# EasyEDA schematic ThrustElectronicBoard2022.json

## Sheets
1 Sheet_1: TITLE: Microcontroller; REV: 0.1; Date: 01-09-2022; Sheet: 1/5; Drawn By: Marcazzan Mirco; Company: Università degli studi di Padova
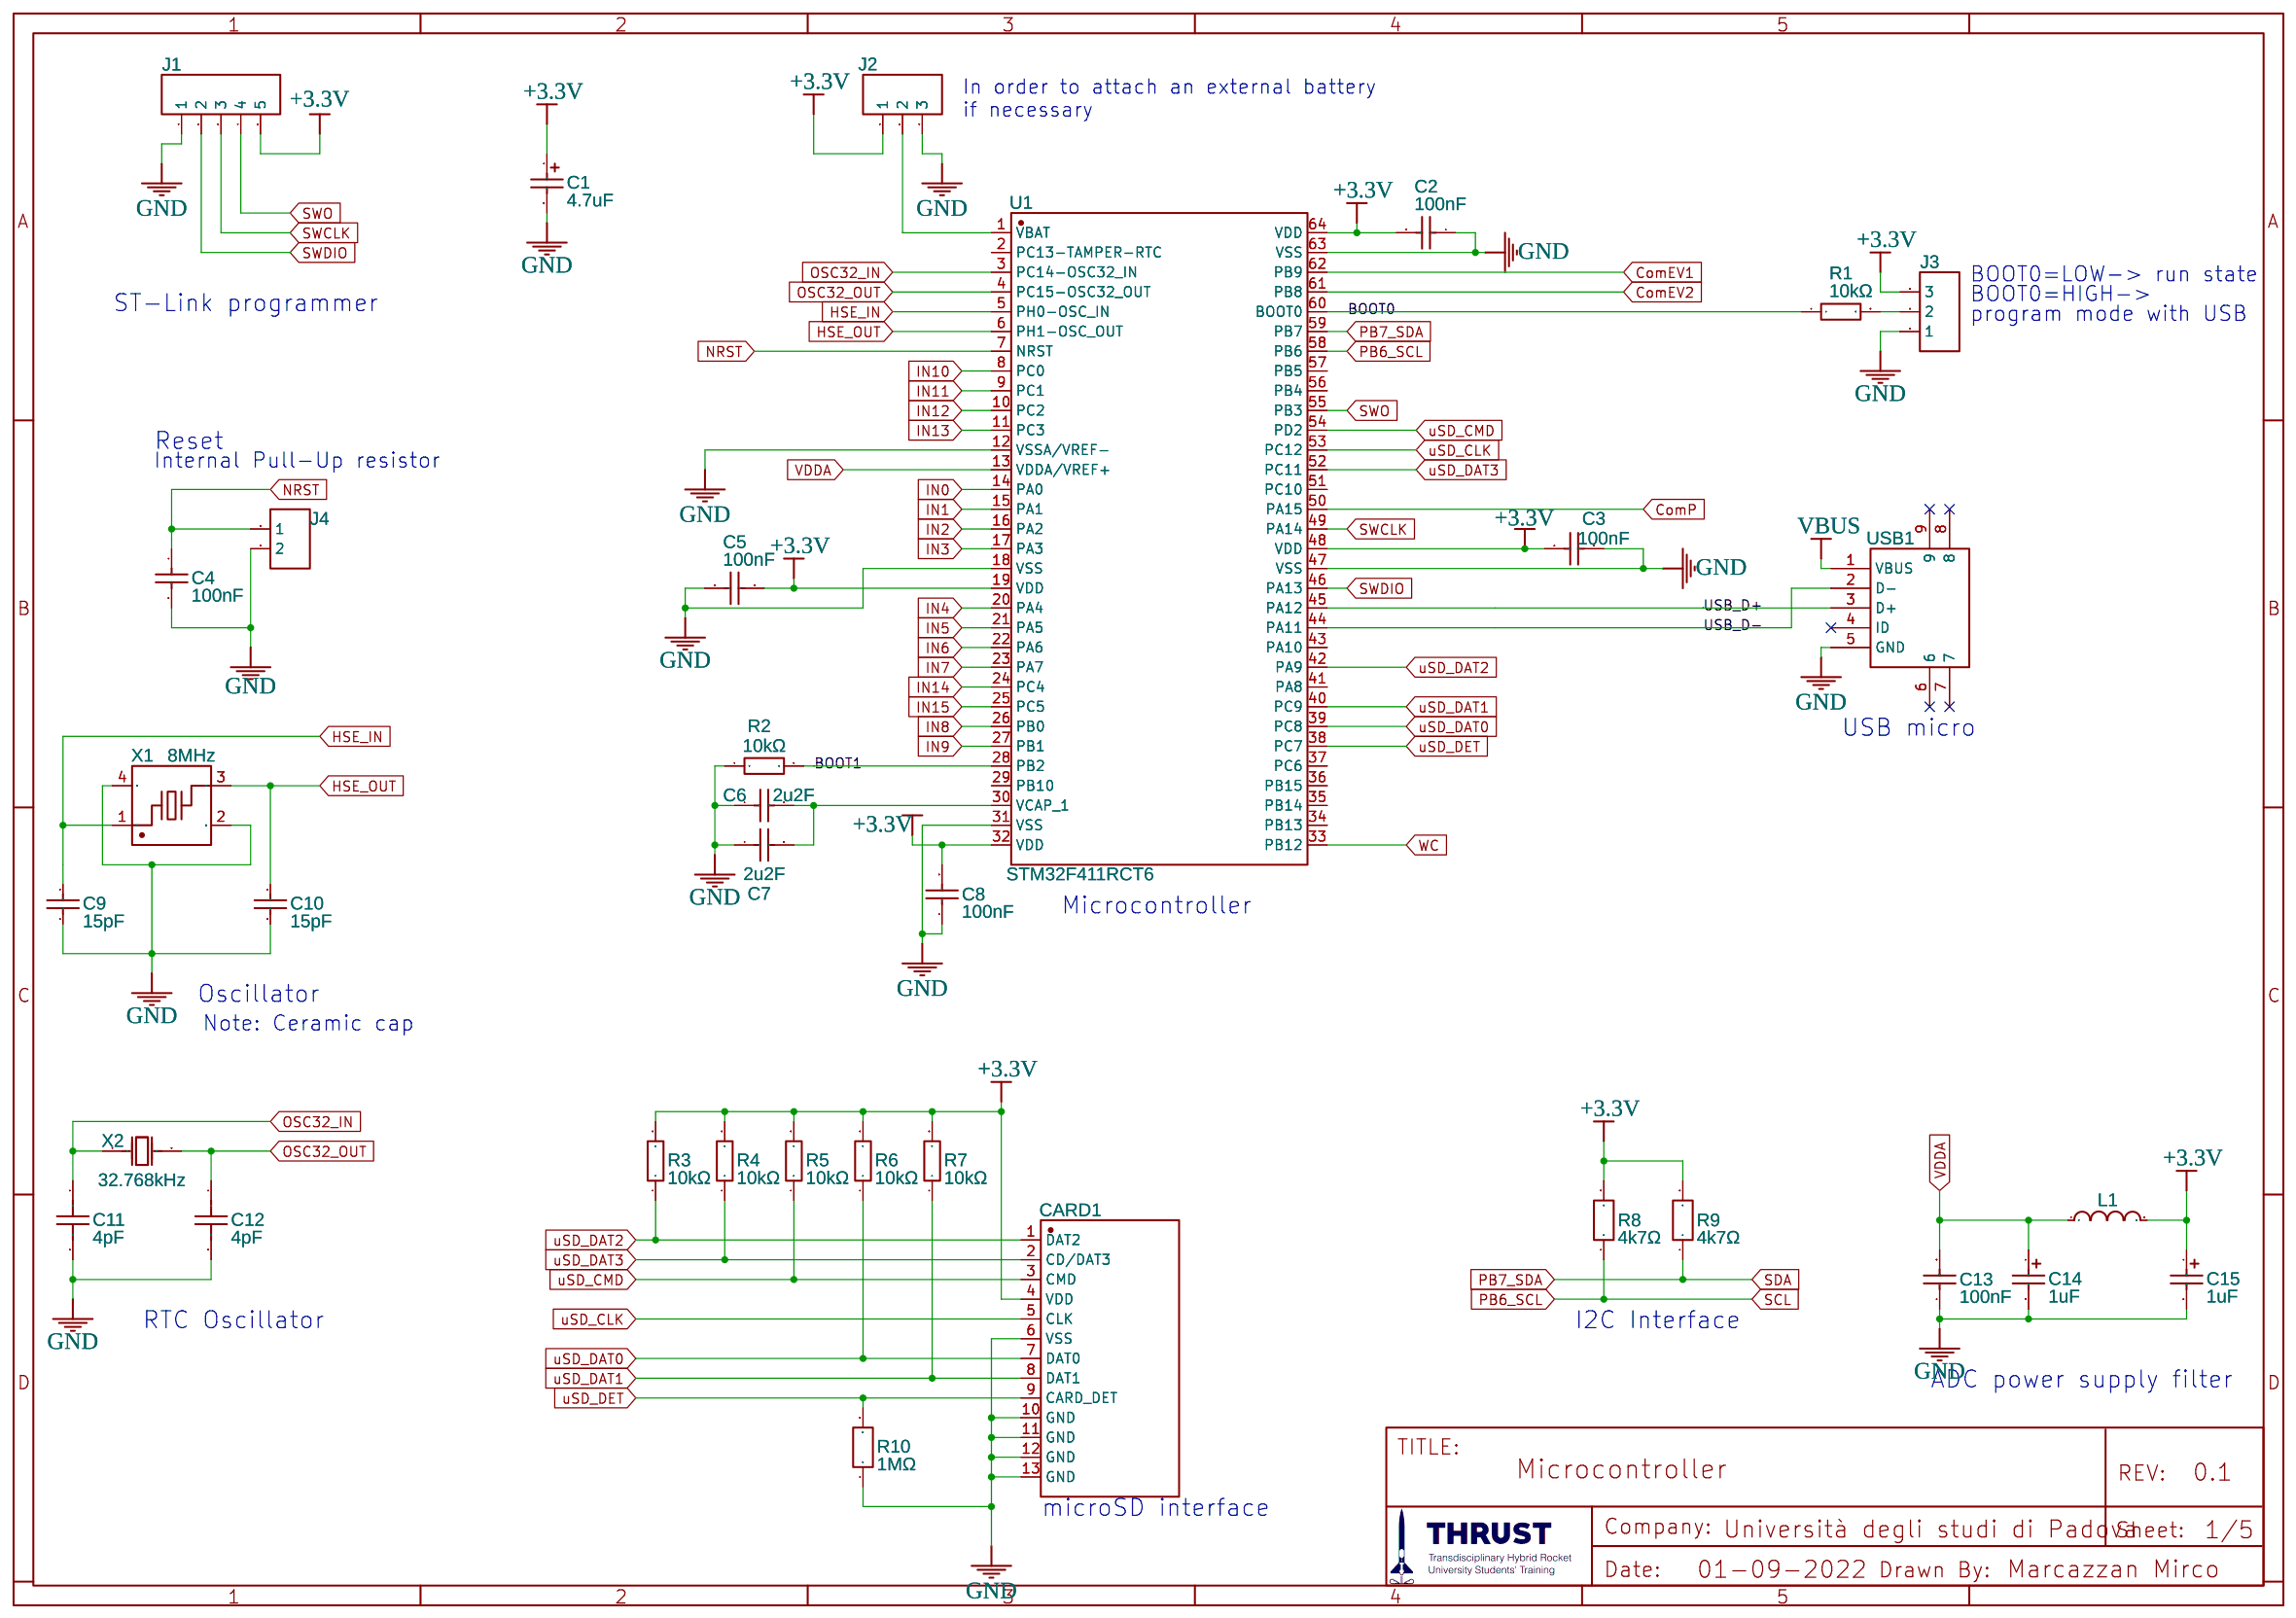
[diagram p0: Sheet_1]
2 Sheet_2: TITLE: IMU, EEPROM; REV: 1.0; Sheet: 2/5
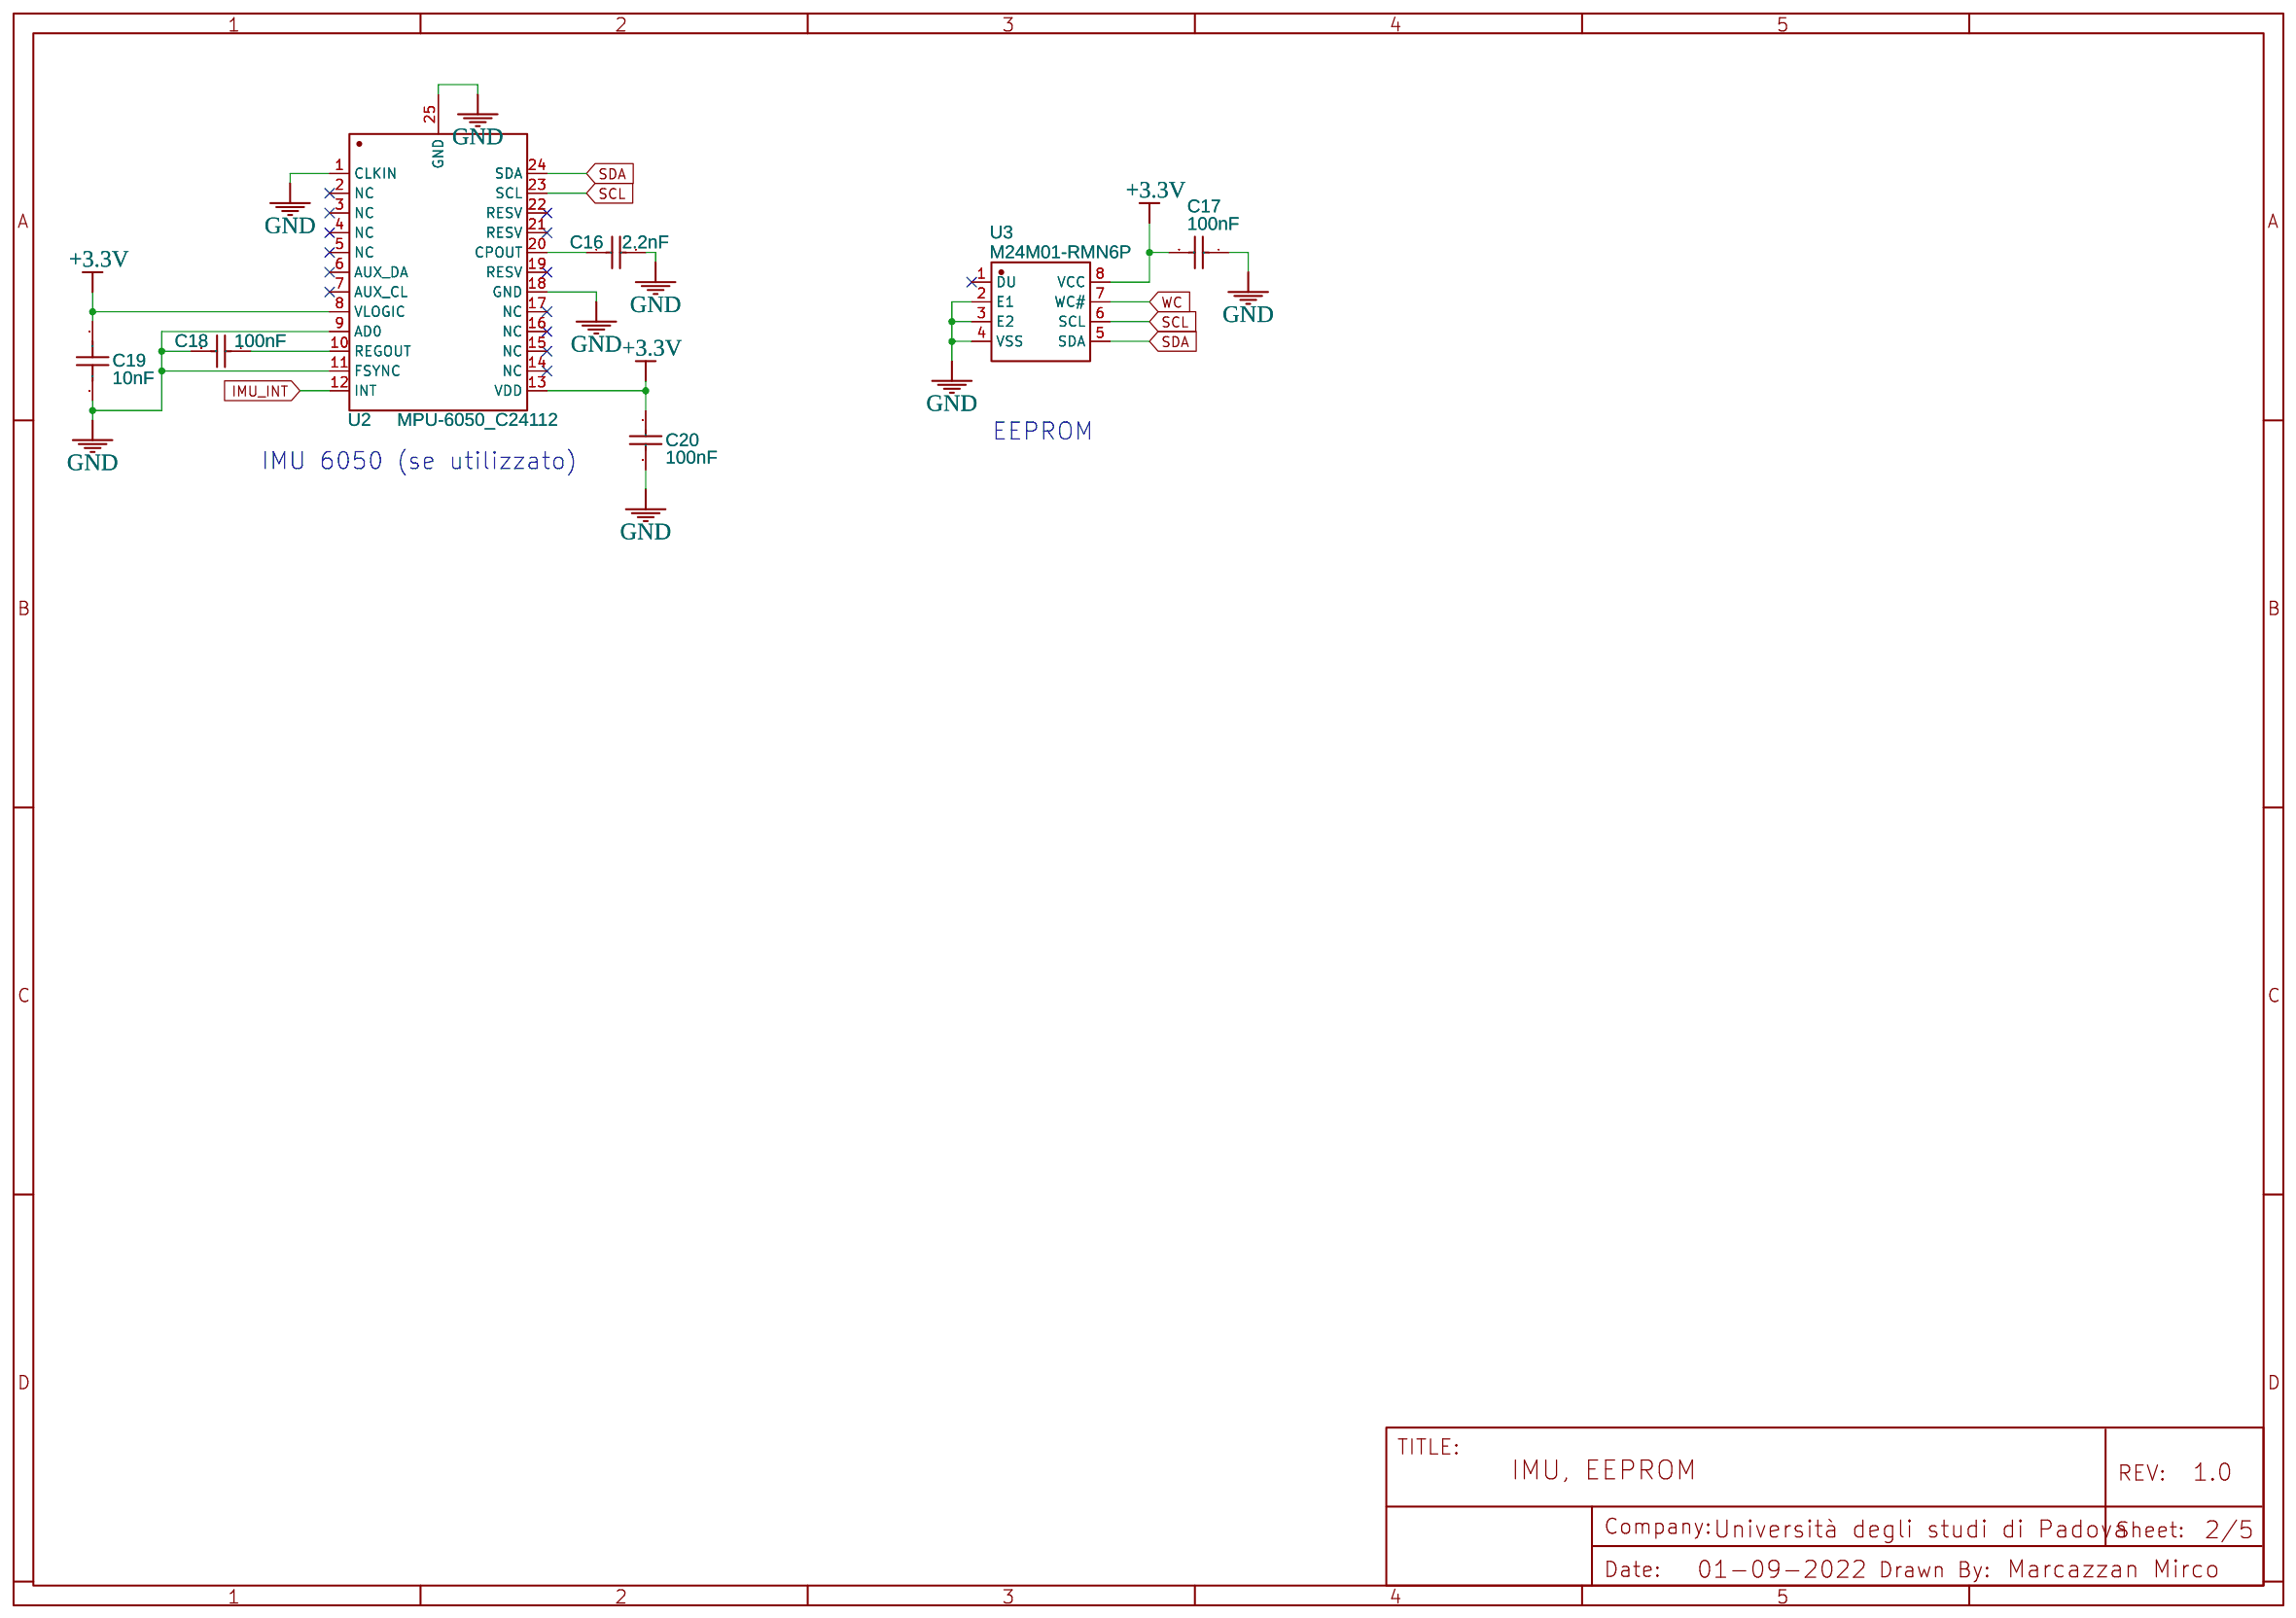
[diagram p1: Sheet_2]
3 Sheet_3: TITLE: Condizionamento sensori; Sheet: 3/5
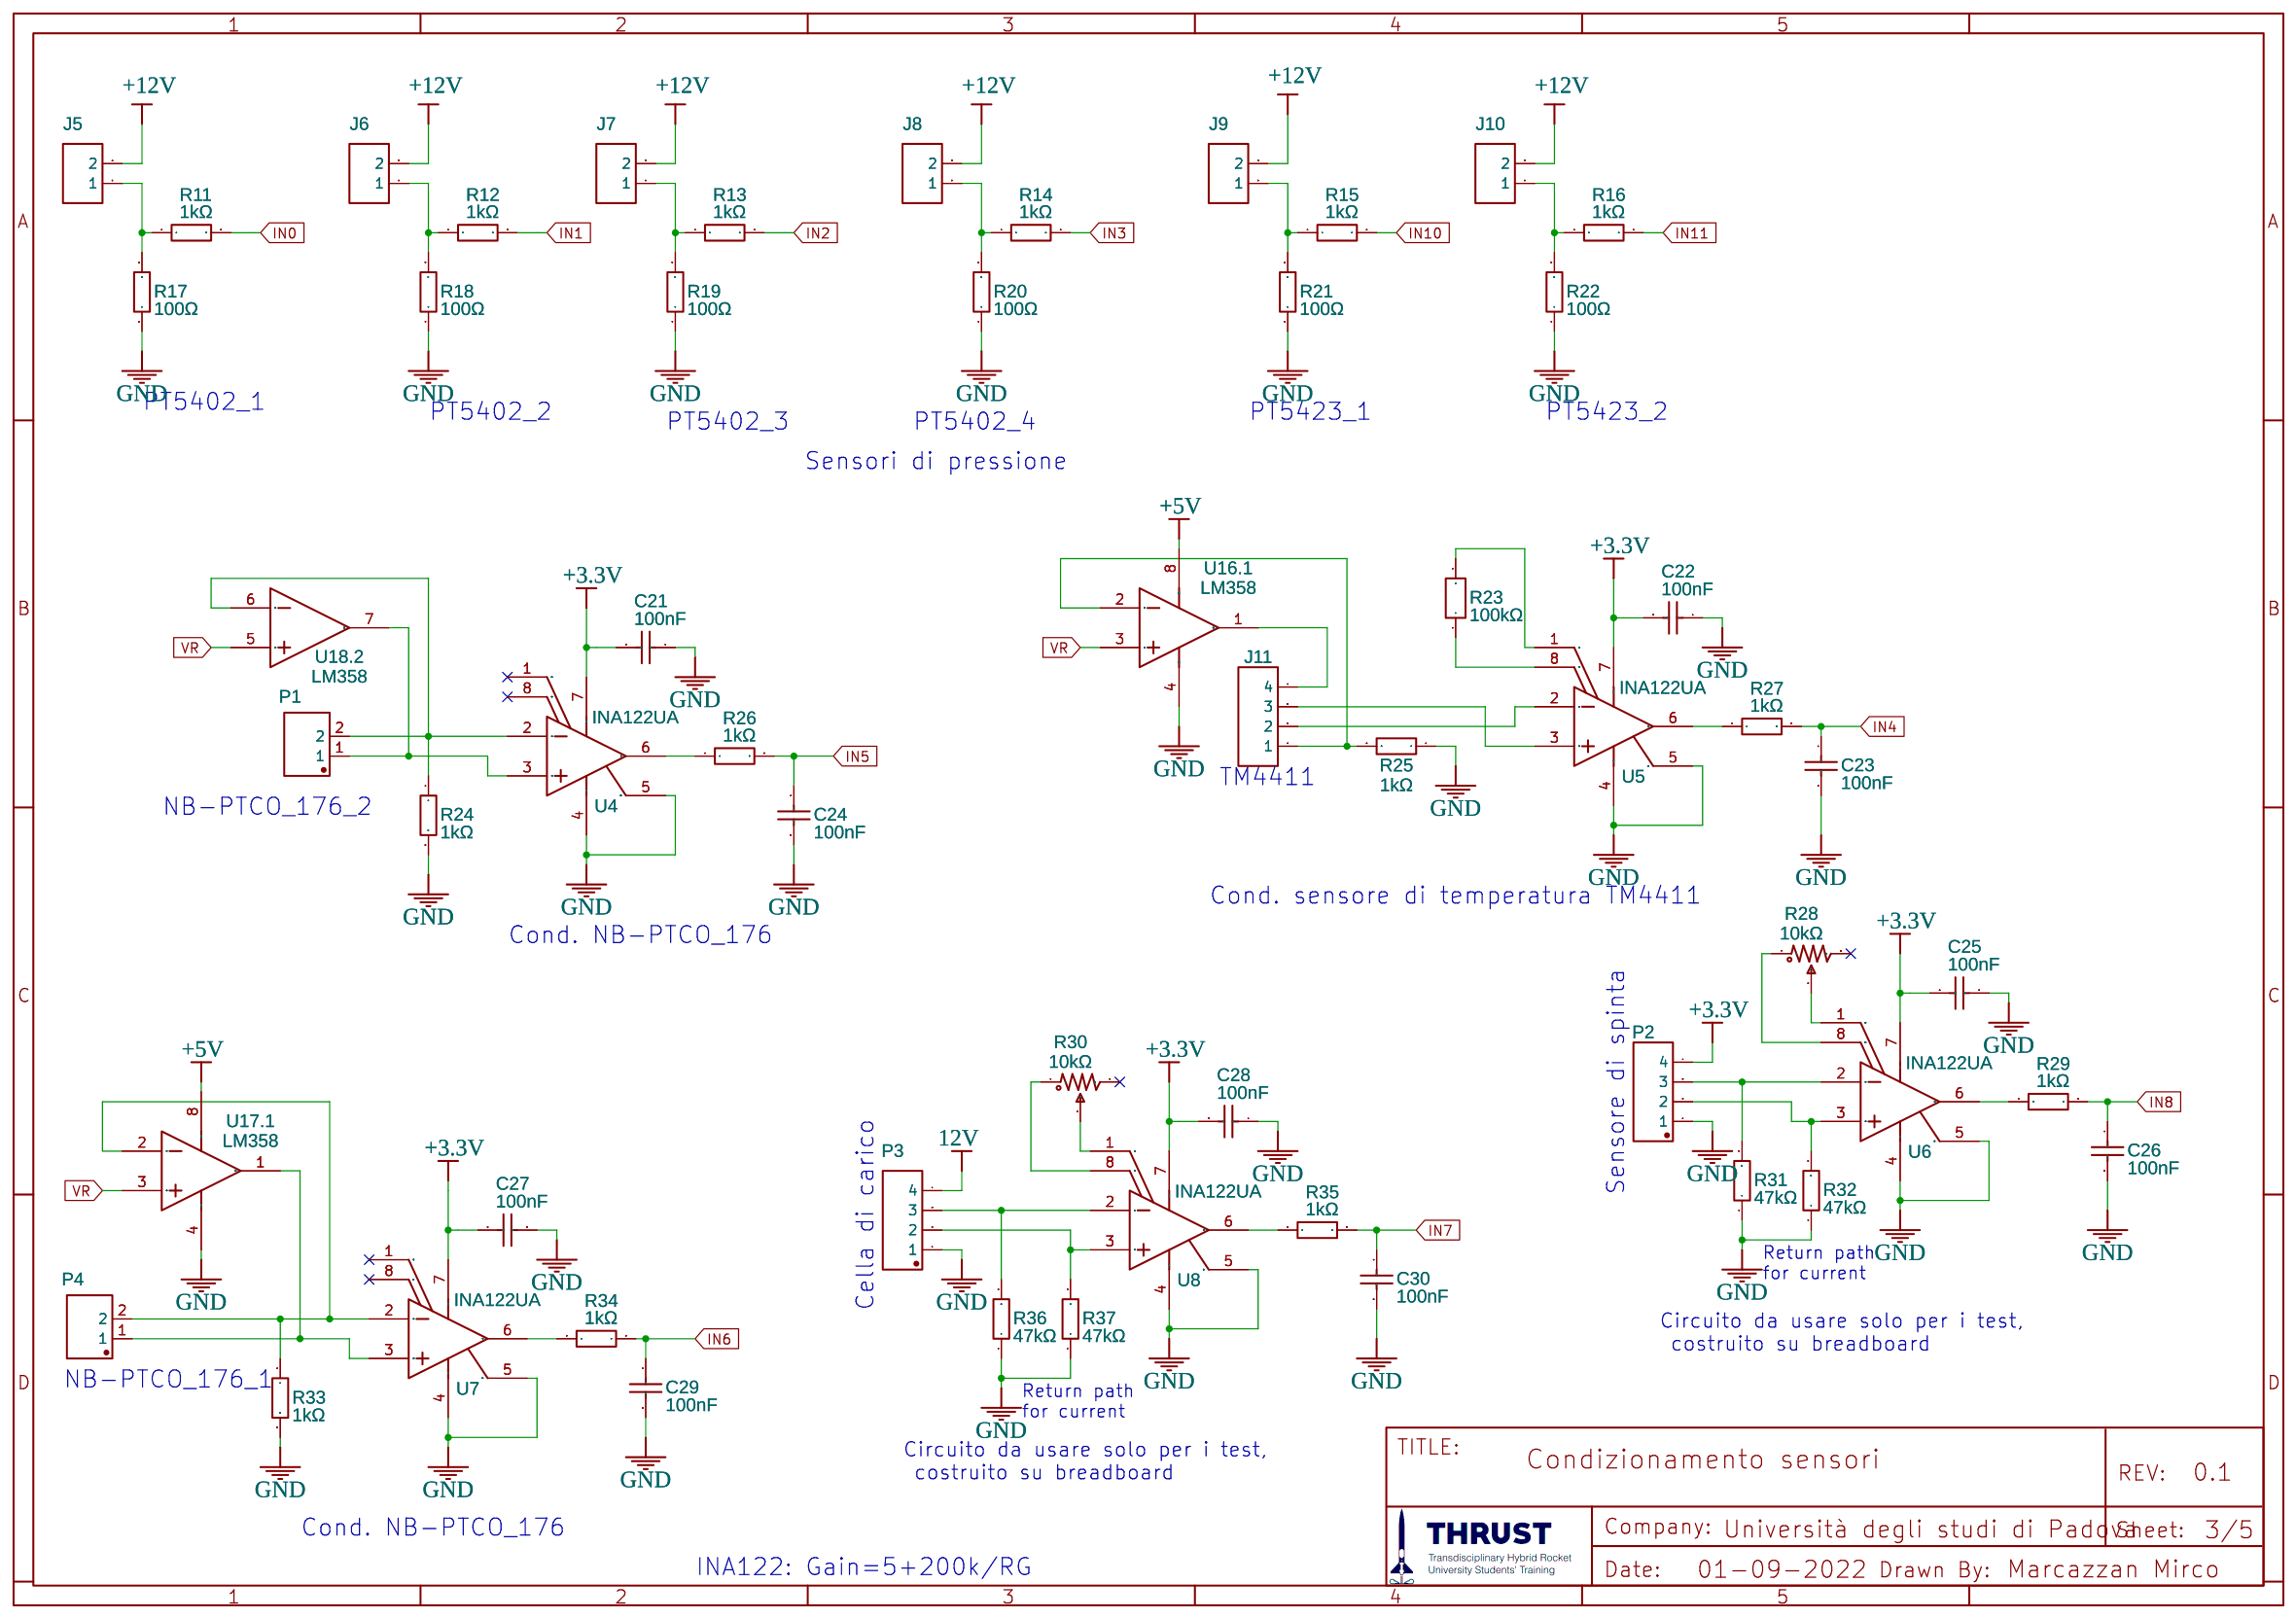
[diagram p2: Sheet_3]
4 Sheet_4: TITLE: Azionamenti; Sheet: 4/5
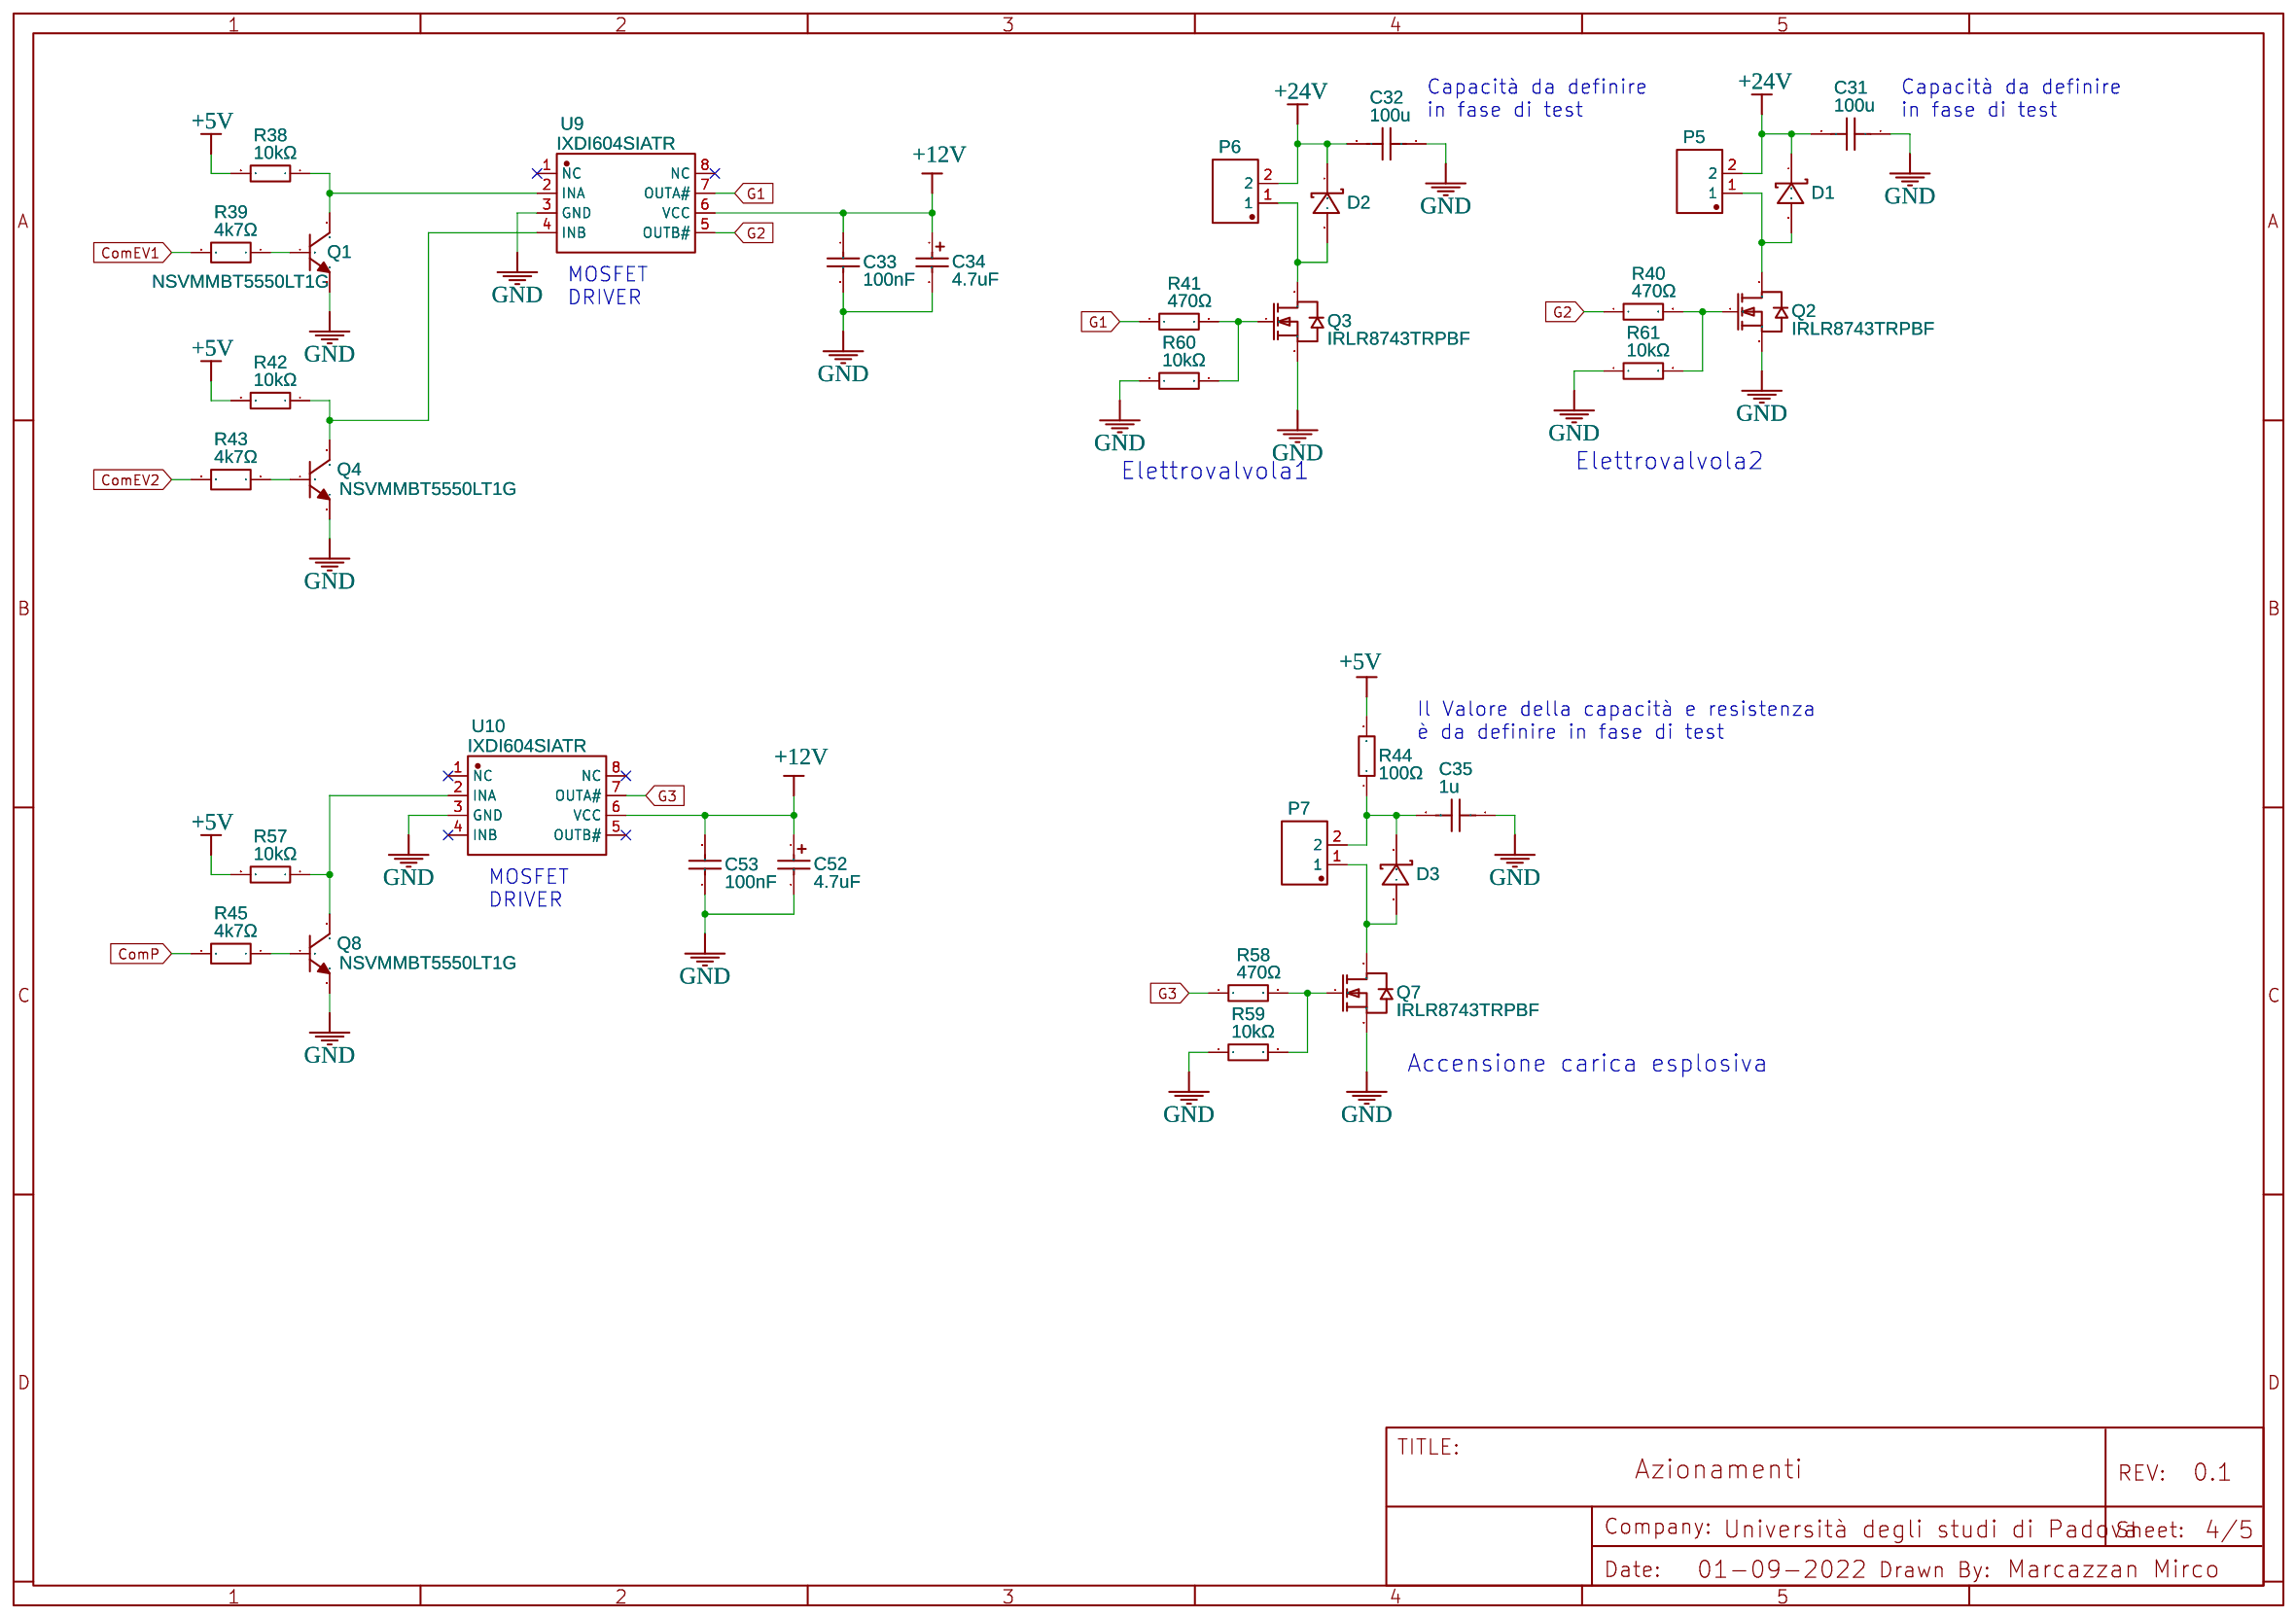
[diagram p3: Sheet_4]
5 Sheet_5: TITLE: Energy management; Sheet: 5/5
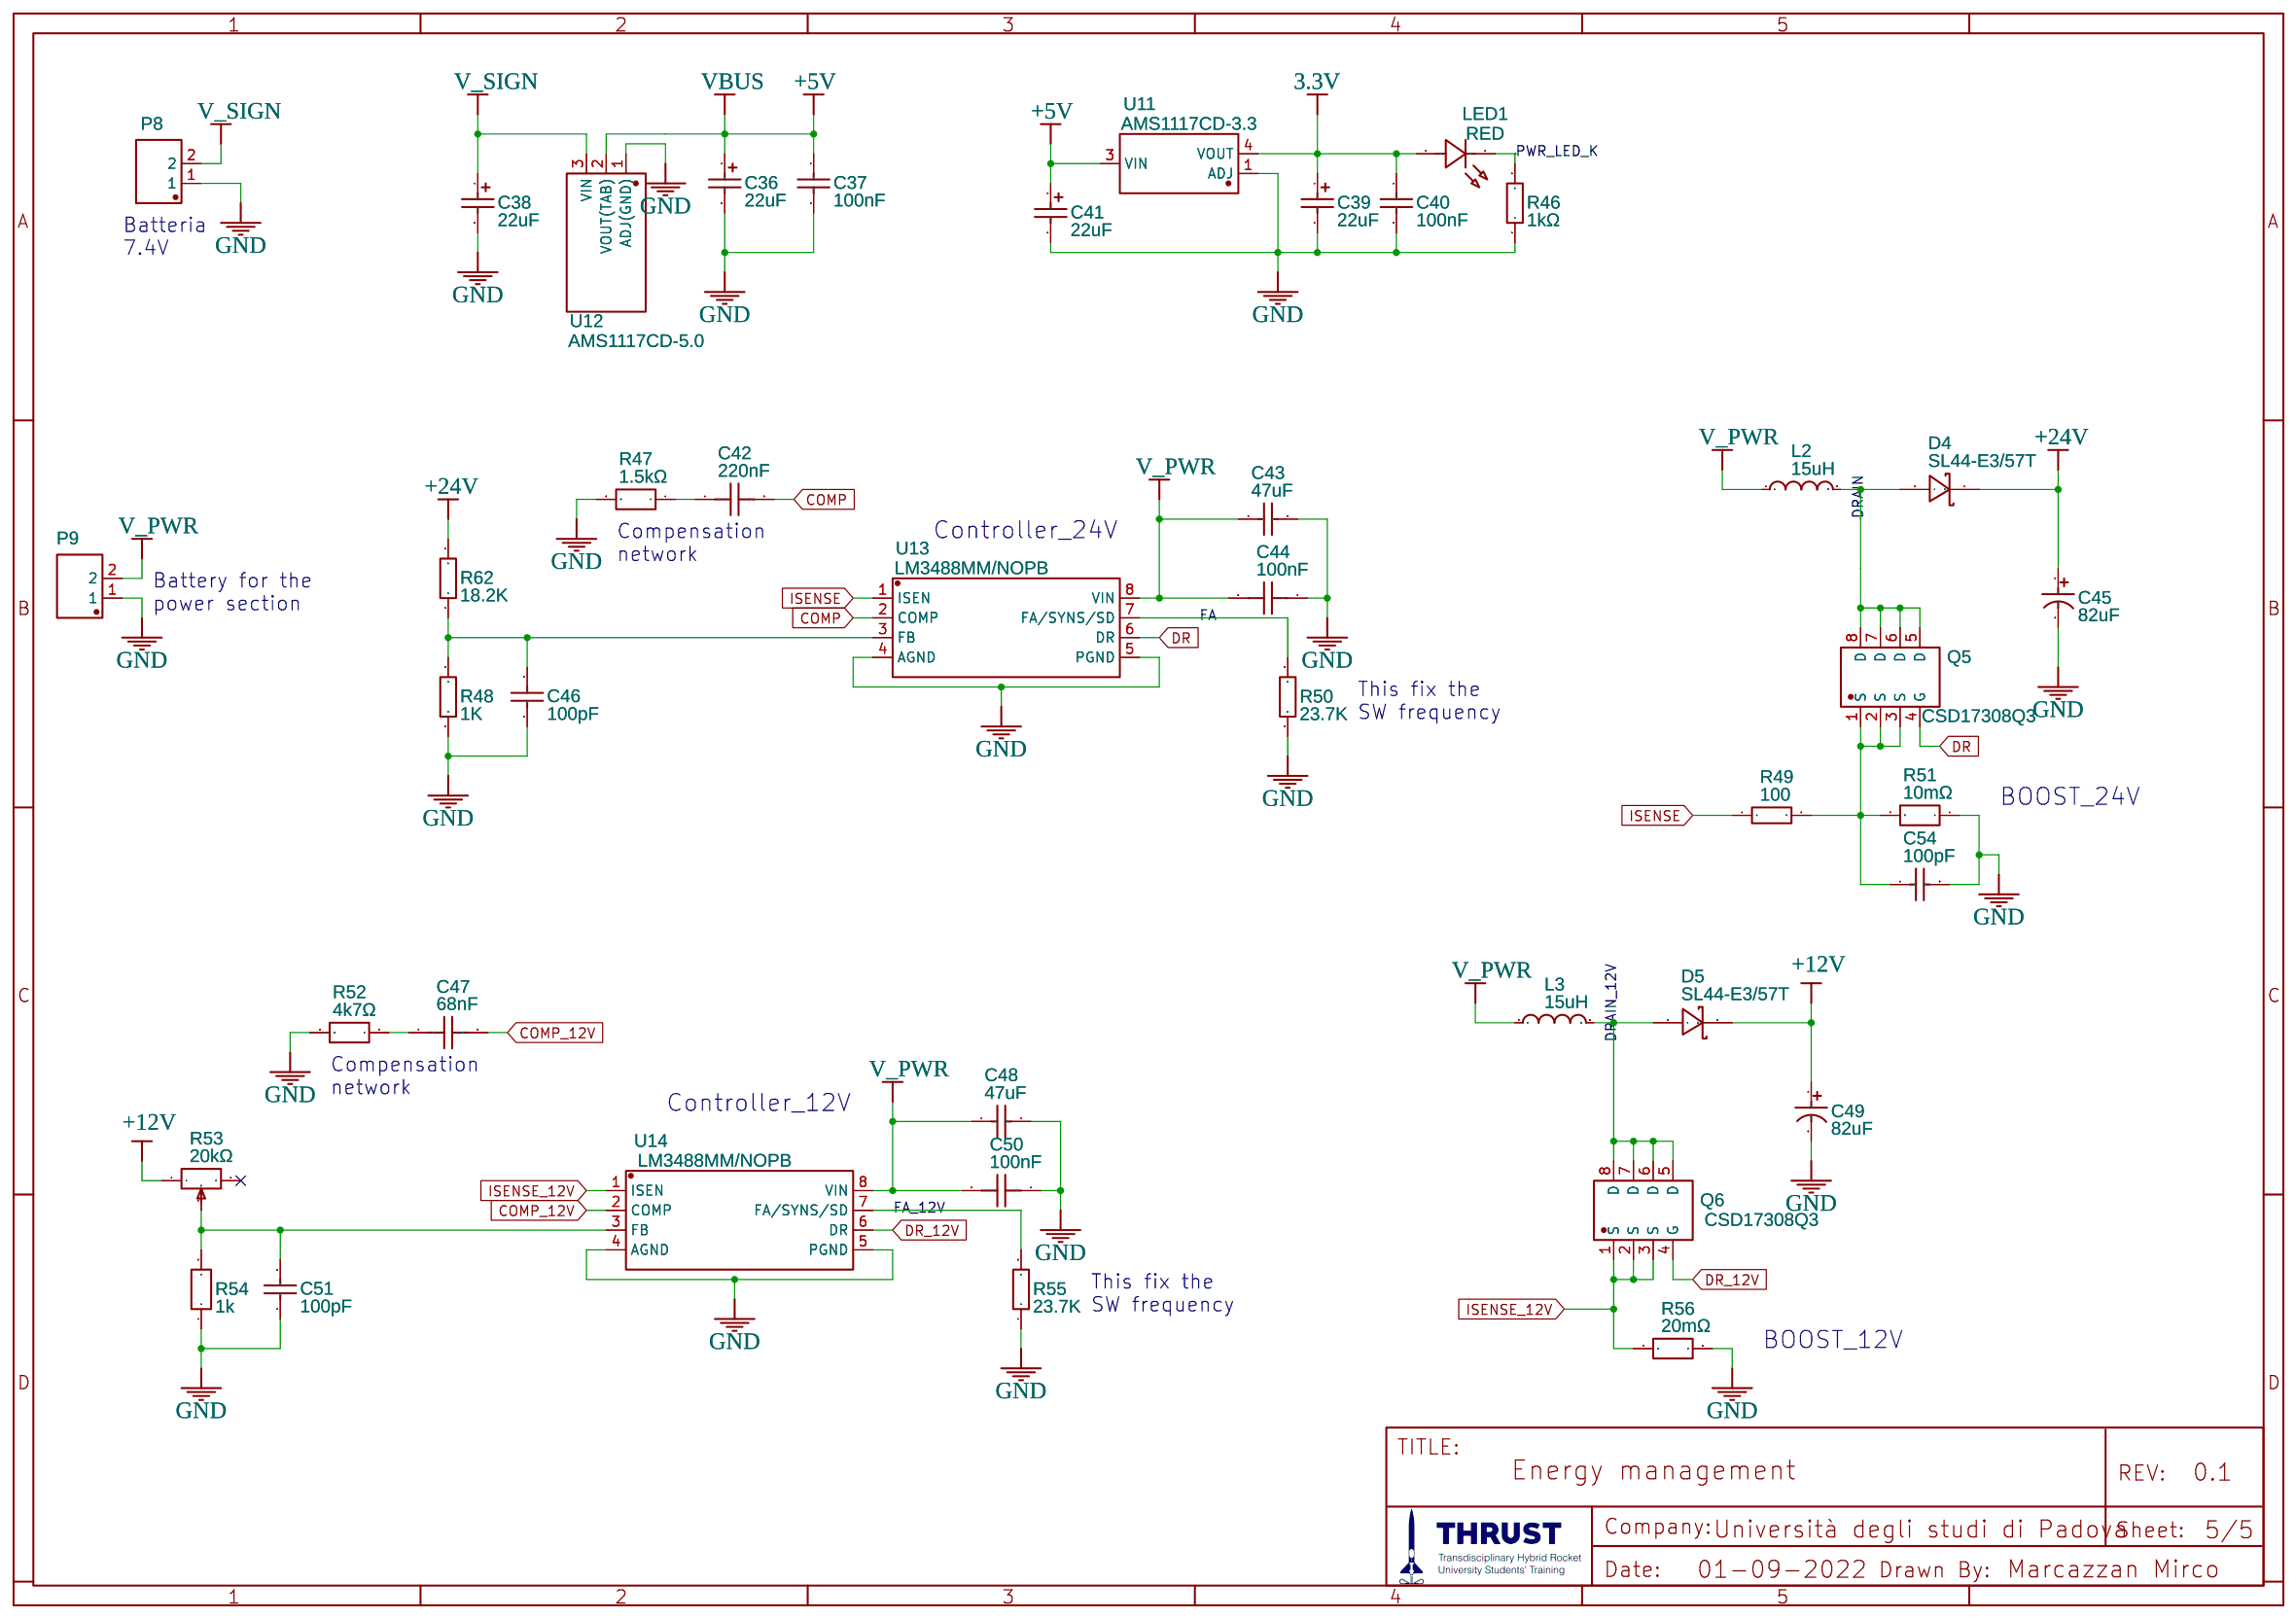
[diagram p4: Sheet_5]

## Parts
sheet Sheet_1
C1  4.7uF  [CAP-SMD_L3.2-W1.6-RD]
C2  100nF  [C0603]
C3  100nF  [C0603]
C4  100nF  [C0603]
C5  100nF  [C0603]
C6  2u2F  [C0402]
C7  2u2F  [C0402]
C8  100nF  [C0603]
C9  15pF  [C0402]
C10  15pF  [C0402]
C11  4pF  [C0402]
C12  4pF  [C0402]
C13  100nF  [C0603]
C14  1uF  [CAP-SMD_L3.2-W1.6-RD]
C15  1uF  [CAP-SMD_L3.2-W1.6-RD]
CARD1  MR01A-01211  [TF-SMD_MR01A-01211]
J1  HDR-M-2.54_1x5  [HDR-M-2.54_1X5]
J2  HDR-M-2.54_1x3  [HDR-M-2.54_1X3]
J3  HDR-M-2.54_1x3  [HDR-M-2.54_1X3]
J4  HDR-M-2.54_1x2  [HDR-M-2.54_1X2]
L1  FCM1608KF-601T05  [L0603]
R1  10kΩ  [R0603]
R2  10kΩ  [R0603]
R3  10kΩ  [R0603]
R4  10kΩ  [R0603]
R5  10kΩ  [R0603]
R6  10kΩ  [R0603]
R7  10kΩ  [R0603]
R8  4k7Ω  [R0402]
R9  4k7Ω  [R0402]
R10  1MΩ  [R0402]
U1  STM32F411RCT6  [LQFP-64_L10.0-W10.0-P0.50-LS12.0-BL]
USB1  U254-051T-4BH83-F1S  [MICRO-USB-SMD_U254-051T-4BH83-F1S]
X1  8MHz  [OSC-SMD_4P-L3.2-W2.5-BL]
X2  32.768kHz  [OSC-SMD_L3.2-W1.5]
sheet Sheet_2
C16  2.2nF  [C0603]
C17  100nF  [C0603]
C18  100nF  [C0603]
C19  10nF  [C0603]
C20  100nF  [C0603]
U2  MPU-6050_C24112  [QFN-24_L4.0-W4.0-P0.50-BL-EP2.7]
U3  M24M01-RMN6P  [SOP-8_L5.0-W3.9-P1.27-LS6.0-BL]
sheet Sheet_3
C21  100nF  [C0603]
C22  100nF  [C0603]
C23  100nF  [C0603]
C24  100nF  [C0603]
C25  100nF  [C0603]
C26  100nF  [C0603]
C27  100nF  [C0603]
C28  100nF  [C0603]
C29  100nF  [C0603]
C30  100nF  [C0603]
J5  HDR-M-2.54_1x2  [HDR-M-2.54_1X2]
J6  HDR-M-2.54_1x2  [HDR-M-2.54_1X2]
J7  HDR-M-2.54_1x2  [HDR-M-2.54_1X2]
J8  HDR-M-2.54_1x2  [HDR-M-2.54_1X2]
J9  HDR-M-2.54_1x2  [HDR-M-2.54_1X2]
J10  HDR-M-2.54_1x2  [HDR-M-2.54_1X2]
J11  HDR-M-2.54_1x4  [HDR-M-2.54_1X4]
P1  WJ2EDGVC-5.08-2P  [WJ2EDGVC-5.08-2P]
P2  WJ2EDGVC-5.08-4P_C8436  [CONN-TH_4P-P5.08_WJ2EDGVC-5.08-4P]
P3  WJ2EDGVC-5.08-4P_C8436  [CONN-TH_4P-P5.08_WJ2EDGVC-5.08-4P]
P4  WJ2EDGVC-5.08-2P  [WJ2EDGVC-5.08-2P]
R11  1kΩ  [R0402]
R12  1kΩ  [R0402]
R13  1kΩ  [R0402]
R14  1kΩ  [R0402]
R15  1kΩ  [R0402]
R16  1kΩ  [R0402]
R17  100Ω  [R0805]
R18  100Ω  [R0805]
R19  100Ω  [R0805]
R20  100Ω  [R0805]
R21  100Ω  [R0805]
R22  100Ω  [R0805]
R23  100kΩ  [R_AXIAL-0.4]
R24  1kΩ  [R0402]
R25  1kΩ  [R0402]
R26  1kΩ  [R0402]
R27  1kΩ  [R0402]
R28  10kΩ  [RES-ADJ-SMD_3P-L4.5-W4.5-P2.35-BL-FS]
R29  1kΩ  [R0402]
R30  10kΩ  [RES-ADJ-SMD_3P-L4.5-W4.5-P2.35-BL-FS]
R31  47kΩ  [R0603]
R32  47kΩ  [R0603]
R33  1kΩ  [R0402]
R34  1kΩ  [R0402]
R35  1kΩ  [R0402]
R36  47kΩ  [R0603]
R37  47kΩ  [R0603]
U4  INA122UA  [SOP-8_L4.9-W3.9-P1.27-LS6.0-BL]
U5  INA122UA  [SOP-8_L4.9-W3.9-P1.27-LS6.0-BL]
U6  INA122UA  [SOP-8_L4.9-W3.9-P1.27-LS6.0-BL]
U7  INA122UA  [SOP-8_L4.9-W3.9-P1.27-LS6.0-BL]
U8  INA122UA  [SOP-8_L4.9-W3.9-P1.27-LS6.0-BL]
U15  LM358D_C2936099  [SO-8_L4.9-W3.9-P1.27-LS5.9-BL]
U16  LM358  [PDIP-8_L9.3-W6.4-P2.54-LS7.6-BL]  (section 1)
U17  LM358  [PDIP-8_L9.3-W6.4-P2.54-LS7.6-BL]  (section 1)
U18  LM358  [PDIP-8_L9.3-W6.4-P2.54-LS7.6-BL]  (section 2)
sheet Sheet_4
C31  100u  [RAD-0.2]
C32  100u  [RAD-0.2]
C33  100nF  [C0603]
C34  4.7uF  [CAP-SMD_L3.2-W1.6-RD]
C35  1u  [RAD-0.2]
C52  4.7uF  [CAP-SMD_L3.2-W1.6-RD]
C53  100nF  [C0603]
D1  MBR0520_C475717  [SOD-123_L2.8-W1.8-LS3.7-RD]
D2  MBR0520_C475717  [SOD-123_L2.8-W1.8-LS3.7-RD]
D3  MBR0520_C475717  [SOD-123_L2.8-W1.8-LS3.7-RD]
P5  WJ2EDGVC-5.08-2P  [WJ2EDGVC-5.08-2P]
P6  WJ2EDGVC-5.08-2P  [WJ2EDGVC-5.08-2P]
P7  WJ2EDGVC-5.08-2P  [WJ2EDGVC-5.08-2P]
Q1  NSVMMBT5550LT1G  [SOT-23-3_L2.9-W1.3-P0.95-LS2.4-BR]
Q2  IRLR8743TRPBF  [TO-252_L6.5-W6.1-P4.58-LS9.9-BR]
Q3  IRLR8743TRPBF  [TO-252_L6.5-W6.1-P4.58-LS9.9-BR]
Q4  NSVMMBT5550LT1G  [SOT-23-3_L2.9-W1.3-P0.95-LS2.4-BR]
Q7  IRLR8743TRPBF  [TO-252_L6.5-W6.1-P4.58-LS9.9-BR]
Q8  NSVMMBT5550LT1G  [SOT-23-3_L2.9-W1.3-P0.95-LS2.4-BR]
R38  10kΩ  [R0603]
R39  4k7Ω  [R0402]
R40  470Ω  [R0805]
R41  470Ω  [R0805]
R42  10kΩ  [R0603]
R43  4k7Ω  [R0402]
R44  100Ω  [R0805]
R45  4k7Ω  [R0402]
R57  10kΩ  [R0603]
R58  470Ω  [R0805]
R59  10kΩ  [R0603]
R60  10kΩ  [R0603]
R61  10kΩ  [R0603]
U9  IXDI604SIATR  [SOIC-8_L4.9-W3.9-P1.27-LS6.0-BL]
U10  IXDI604SIATR  [SOIC-8_L4.9-W3.9-P1.27-LS6.0-BL]
sheet Sheet_5
C36  22uF  [CAP-SMD_L3.5-W2.8-R-RD]
C37  100nF  [C0603]
C38  22uF  [CAP-SMD_L3.5-W2.8-R-RD]
C39  22uF  [CAP-SMD_L3.5-W2.8-R-RD]
C40  100nF  [C0603]
C41  22uF  [CAP-SMD_L3.5-W2.8-R-RD]
C42  220nF  [C0603]
C43  47uF  [C1206]
C44  100nF  [C0603]
C45  82uF  [CAP-SMD_BD8.0-L8.3-W8.3-FD]
C46  100pF  [C0805]
C47  68nF  [C0805]
C48  47uF  [C1206]
C49  82uF  [CAP-SMD_BD8.0-L8.3-W8.3-FD]
C50  100nF  [C0603]
C51  100pF  [C0805]
C54  100pF  [C0805]
D4  SL44-E3/57T  [SMC_L6.9-W5.9-LS7.9-RD]
D5  SL44-E3/57T  [SMC_L6.9-W5.9-LS7.9-RD]
L2  15uH  [IND-SMD_L13.5-W12.6]
L3  15uH  [IND-SMD_L11.5-W10.0_FXL1040]
LED1  RED  [LED0805-RD_RED]
P8  WJ2EDGVC-5.08-2P  [WJ2EDGVC-5.08-2P]
P9  WJ2EDGVC-5.08-2P  [WJ2EDGVC-5.08-2P]
Q5  CSD17308Q3  [VSON-CLIP-8_L3.3-W3.3-P0.65-BL]
Q6  CSD17308Q3  [VSON-CLIP-8_L3.3-W3.3-P0.65-BL]
R46  1kΩ  [R0402]
R47  1.5kΩ  [R0603]
R48  1K  [R0805]
R49  100  [R0805]
R50  23.7K  [R0805]
R51  10mΩ  [R2512]
R52  4k7Ω  [R0402]
R53  20kΩ  [RES-ADJ-TH_3362P]
R54  1k  [R_AXIAL-0.4]
R55  23.7K  [R0805]
R56  20mΩ  [R1210]
R62  18.2K  [R0805]
U11  AMS1117CD-3.3  [TO-252-2_L6.5-W6.1-P4.58-LS10.0-BR]
U12  AMS1117CD-5.0  [TO-252-2_L6.6-W6.1-P4.60-LS9.5-BR]
U13  LM3488MM/NOPB  [MSOP-8_L3.0-W3.0-P0.65-LS5.0-BL]
U14  LM3488MM/NOPB  [MSOP-8_L3.0-W3.0-P0.65-LS5.0-BL]

## Library data of the parts
C1 C34 C52 = TC211A475M016Y: Supplier: LCSC; Manufacturer: Sunlord; Supplier Part: C128333; JLCPCB Part Class: Extended Part
C2-C5 C8 C13 C17 C18 C20-C30 C33 C37 C40 C53 = CGA3E2X7R1H104KT0Y0N: Supplier: LCSC; Manufacturer: TDK; Supplier Part: C76711; JLCPCB Part Class: Extended Part
C6 C7 = GRM155R60J225ME15D: Supplier: LCSC; Manufacturer: MuRata; Supplier Part: C76993; JLCPCB Part Class: Extended Part
C9 C10 = GJM1555C1H150FB01D: Supplier: LCSC; Supplier Part: C441742; Manufacturer: Murata Electronics; Contributor: LCSC; JLCPCB Part Class: Extended Part
C11 C12 = GJM1555C1H4R0BB01D: Supplier: LCSC; Manufacturer: MuRata; Contributor: LCSC; Supplier Part: C161323; JLCPCB Part Class: Extended Part
C14 C15 = TAJA105K025RNJ: Supplier: LCSC; Manufacturer: AVX; Supplier Part: C7175; JLCPCB Part Class: Extended Part
CARD1 = MR01A-01211: Supplier: LCSC; Supplier Part: C479742; Manufacturer: ATOM(爱特姆); Contributor: LCSC; JLCPCB Part Class: Extended Part
J1 = HDR-M-2.54_1x5: Supplier Part: C358687; Supplier: LCSC; Contributor: LCEDA_Lib
J2 J3 = HDR-M-2.54_1x3: Supplier Part: C180248; Supplier: LCSC; Contributor: LCEDA_Lib
J4-J10 = HDR-M-2.54_1x2: Supplier Part: C124375; Supplier: LCSC; Contributor: LCEDA_Lib
L1 = FCM1608KF-601T05: Supplier: LCSC; Supplier Part: C133937; Manufacturer: TAITEC; Contributor: LCSC; JLCPCB Part Class: Extended Part
R1-R7 R38 R42 R57 R59-R61 = ERJ3GEYJ103V: Supplier: LCSC; Manufacturer: PANASONIC; Resistance (Ohms): 10K; Contributor: LCSC; Supplier Part: C169849; JLCPCB Part Class: Extended Part
R8 R9 R39 R43 R45 R52 = ERJ2GEJ472X: Supplier: LCSC; Supplier Part: C413001; Manufacturer: PANASONIC; Resistance (Ohms): 4.7K; Contributor: LCSC; JLCPCB Part Class: Extended Part
R10 = ERJ2RKF1004X: Supplier: LCSC; Supplier Part: C413126; Manufacturer: PANASONIC; Resistance (Ohms): 1M; Contributor: LCSC; JLCPCB Part Class: Extended Part
U1 = STM32F411RCT6: Supplier: LCSC; Supplier Part: C222222; Manufacturer: STMicroelectronics; Contributor: LCSC; JLCPCB Part Class: Extended Part
USB1 = U254-051T-4BH83-F1S: Supplier: LCSC; Supplier Part: C397452; Manufacturer: XKB Enterprise; Contributor: LCSC; JLCPCB Part Class: Extended Part
X1 = X32258MOB4SI: Supplier: LCSC; Supplier Part: C2682775; Manufacturer: YXC扬兴科技; JLCPCB Part Class: Extended Part; Contributor: LCSC
X2 = S3132768072070: Supplier: LCSC; Supplier Part: C479189; Manufacturer: JGHC; Contributor: LCSC; JLCPCB Part Class: Extended Part
C16 = C1608C0G1H222JT000N: Supplier: LCSC; Manufacturer: TDK; Supplier Part: C76601; JLCPCB Part Class: Extended Part
C19 = CGA3E2X7R1H103KT0Y0N: Supplier: LCSC; Supplier Part: C342901; Manufacturer: TDK; Contributor: LCSC; JLCPCB Part Class: Extended Part
U2 = MPU-6050_C24112: sourceId: 1T5FDZYC8; Supplier: LCSC; Manufacturer: InvenSense; Manufacturer Part: MPU-6050; Supplier Part: C24112; JLCPCB Part Class: Basic Part
U3 = M24M01-RMN6P: Supplier: LCSC; Supplier Part: C1349431; Manufacturer: ST(意法半导体); Contributor: LCSC; JLCPCB Part Class: Extended Part
J11 = HDR-M-2.54_1x4: Supplier Part: C124378; Supplier: LCSC; Contributor: LCEDA_Lib
P1 P4-P9 = -: Supplier: LCSC; Manufacturer Part: ?; Supplier Part: C8445
P2 P3 = WJ2EDGVC-5.08-4P_C8436: Supplier: LCSC; Manufacturer: ReliaPro; Manufacturer Part: WJ2EDGVC-5.08-4P; Supplier Part: C8436; JLCPCB Part Class: Extended Part
R11-R16 R24-R27 R29 R33-R35 R46 = ERJ2RKF1001X: Supplier: LCSC; Supplier Part: C242161; Manufacturer: PANASONIC; Resistance (Ohms): 1K; Contributor: LCSC; JLCPCB Part Class: Extended Part
R17-R22 R44 = RS-05K1000FT: Supplier: LCSC; Supplier Part: C115424; Manufacturer: Guangdong Fenghua Advanced Tech; Resistance (Ohms): 100; Contributor: LCSC; JLCPCB Part Class: Extended Part
R23 R54 = R_AXIAL-0.4_EU: Contributor: LCEDA_Lib
R28 R30 = 3314J-2-103E: Supplier: LCSC; Supplier Part: C780127; Manufacturer: BOURNS; JLCPCB Part Class: Extended Part; Contributor: LCSC
R31 R32 R36 R37 = ERJ3EKF4702V: Supplier: LCSC; Supplier Part: C278626; Manufacturer: PANASONIC; Resistance (Ohms): 47K; Contributor: LCSC
U4-U8 = INA122UA: Supplier: LCSC; Manufacturer: TI; Supplier Part: C40768; JLCPCB Part Class: Extended Part
U15 = LM358D_C2936099: Supplier: LCSC; Supplier Part: C2936099; Manufacturer: ST(意法半导体); Manufacturer Part: LM358D; link: https://atta.szlcsc.com//upload/public/pdf/source/20220211/86857E2EABC1585834966B2A2DDBE729.pdf; subpart_no: 1; JLCPCB Part Class: Extended Part
U16 U17 = LM358_C5157924: Supplier: LCSC; Supplier Part: C5157924; Manufacturer: Gcore(扬州国芯); link: https://atta.szlcsc.com/upload/public/pdf/source/20220906/3ACE6D6B047AB904F15AF865A5390D58.pdf; subpart_no: 1; Contributor: lcsc
U18 = LM358_C5157924: Supplier: LCSC; Supplier Part: C5157924; Manufacturer: Gcore(扬州国芯); link: https://atta.szlcsc.com/upload/public/pdf/source/20220906/3ACE6D6B047AB904F15AF865A5390D58.pdf; subpart_no: 2; Contributor: lcsc
C31 C32 C35 = C_RAD-0.2_US: Contributor: LCEDA_Lib
D1-D3 = MBR0520_C475717: Supplier: LCSC; Supplier Part: C475717; Manufacturer: Shikues; Manufacturer Part: MBR0520; Contributor: LCSC; JLCPCB Part Class: Extended Part
Q1 Q4 Q8 = NSVMMBT5550LT1G: Supplier: LCSC; Supplier Part: C893942; Manufacturer: onsemi(安森美); Contributor: lcsc
Q2 Q3 Q7 = IRLR8743TRPBF_C3040285: Supplier: LCSC; Supplier Part: C3040285; Manufacturer: VBsemi(台湾微碧); Contributor: lcsc
R40 R41 R58 = AECR0805F470RK9: Supplier: LCSC; Supplier Part: C328396; Manufacturer: ResistorToday; Resistance (Ohms): 470; Contributor: LCSC
U9 U10 = IXDI604SIATR: Supplier: LCSC; Supplier Part: C2677101; Manufacturer: IXYS; Contributor: LCSC; JLCPCB Part Class: Extended Part
C36 C38 C39 C41 = TAJB226K020RNJ: Supplier: LCSC; Manufacturer: AVX; Supplier Part: C7199; JLCPCB Part Class: Extended Part
C42 = CC0603ZRY5V8BB224: Supplier: LCSC; Supplier Part: C113814; Manufacturer: YAGEO; Contributor: LCSC; JLCPCB Part Class: Extended Part
C43 C48 = C3216X5R1E476MTJ00E: Supplier: LCSC; Manufacturer: TDK; Supplier Part: C76659; JLCPCB Part Class: Extended Part
C44 C50 = GRM188R71E104KA01D: Supplier: LCSC; Manufacturer: MuRata; Supplier Part: C77050; JLCPCB Part Class: Extended Part
C45 C49 = 35SVPF82M: Supplier: LCSC; Supplier Part: C188358; Manufacturer: PANASONIC; Contributor: LCSC; JLCPCB Part Class: Extended Part
C46 C51 C54 = C2012C0G2A101JT000N: Supplier: LCSC; Manufacturer: TDK; Supplier Part: C76633; JLCPCB Part Class: Extended Part
C47 = CC0805JRX7R8BB683: Supplier: LCSC; Supplier Part: C520040; Manufacturer: YAGEO; Contributor: LCSC; JLCPCB Part Class: Extended Part
D4 D5 = SL44-E3/57T: Supplier: LCSC; Supplier Part: C506645; Manufacturer: Vishay Intertech; Contributor: LCSC; JLCPCB Part Class: Extended Part
L2 = MDA1365-150M: Supplier: LCSC; Supplier Part: C2847584; Manufacturer: KOHERelec(科或); Contributor: LCSC; JLCPCB Part Class: Extended Part
L3 = FXL1040-150-M: Supplier: LCSC; Supplier Part: C475916; Manufacturer: cjiang(Changjiang Microelectronics Tech); Contributor: LCSC; JLCPCB Part Class: Extended Part
LED1 = XL-2012SURC: Supplier: LCSC; Supplier Part: C965812; Manufacturer: XINGLIGHT(成兴光); JLCPCB Part Class: Extended Part; Contributor: LCSC
Q5 Q6 = CSD17308Q3: Supplier: LCSC; Supplier Part: C294987; Manufacturer: Texas Instruments; Contributor: LCSC; JLCPCB Part Class: Extended Part
R47 = ERJ3GEYJ152V: Supplier: LCSC; Supplier Part: C403431; Manufacturer: PANASONIC; Resistance (Ohms): 1.5K; Contributor: LCSC; JLCPCB Part Class: Extended Part
R48 = RC0805FR-071KL: Supplier: LCSC; Manufacturer: YAGEO; Supplier Part: C95781; JLCPCB Part Class: Extended Part; Resistance: 1kΩ
R49 = RC0805FR-07100RL: Supplier: LCSC; Manufacturer: YAGEO; Supplier Part: C105577; JLCPCB Part Class: Extended Part; Resistance: 100Ω
R50 R55 = AC0805FR-0723K7L: Supplier: LCSC; Supplier Part: C228649; Manufacturer: YAGEO; Contributor: LCSC; JLCPCB Part Class: Extended Part; Resistance: 23.7kΩ
R51 = 25121WJ010LT4E: Supplier: LCSC; Supplier Part: C473634; Manufacturer: UNI-ROYAL(Uniroyal Elec); Resistance (Ohms): 0.01; Contributor: LCSC; JLCPCB Part Class: Extended Part
R53 = 3362P-1-203LF: Supplier: LCSC; Manufacturer: BOURNS; Supplier Part: C81263; Resistance(Ohms): 20K; Resistance (Ohms): 20K; JLCPCB Part Class: Extended Part
R56 = 1210W2J020LT5E: Supplier: LCSC; Supplier Part: C407155; Manufacturer: Uniroyal Elec; Resistance (Ohms): 0.02; Contributor: LCSC; JLCPCB Part Class: Extended Part
R62 = AC0805FR-0718K2L: Supplier: LCSC; Supplier Part: C228352; Manufacturer: YAGEO; Contributor: LCSC; JLCPCB Part Class: Extended Part; Resistance: 18.2kΩ
U11 = AMS1117CD-3.3_C347249: Supplier: LCSC; Supplier Part: C347249; Manufacturer: UMW(友台半导体); Contributor: LCSC; JLCPCB Part Class: Extended Part
U12 = AMS1117CD-5.0_C347250: Supplier: LCSC; Supplier Part: C347250; Manufacturer: UMW(友台半导体); Contributor: LCSC; JLCPCB Part Class: Extended Part
U13 U14 = LM3488MM/NOPB: Supplier: LCSC; Supplier Part: C80773; Manufacturer: Texas Instruments; Contributor: LCSC; JLCPCB Part Class: Extended Part

## Nets
3.3V: C39.1 C40.1 LED1.2(A) U11.4(VOUT)
12V: P3.4
+3.3V: C1.1 C2.2 C3.2 C5.2 C8.2 C15.1 C17.2 C19.1 C20.2 C21.2 C22.2 C25.2 C27.2 C28.2 CARD1.4(VDD) J1.5 J2.1 J3.3 L1.2 P2.4 R3.2 R4.2 R5.2 R6.2 R7.2 R8.2 R9.2 U1.19(VDD) U1.32(VDD) U1.48(VDD) U1.64(VDD) U2.8(VLOGIC) U2.13(VDD) U3.8(VCC) U4.7(V+) U5.7(V+) U6.7(V+) U7.7(V+) U8.7(V+)
+5V: C36.1 C37.1 C41.1 R38.2 R42.2 R44.2 R57.2 U11.3(VIN) U12.2(VOUT(TAB)) U16.8(VCC) U17.8(VCC) USB1.1(VBUS)
+12V: C33.1 C34.1 C49.1 C52.1 C53.1 D5.1(C) J5.2 J6.2 J7.2 J8.2 J9.2 J10.2 R53.1 U9.6(VCC) U10.6(VCC)
+24V: C31.2 C32.2 C45.1 D1.1(C) D2.1(C) D4.1(C) P5.2 P6.2 R62.2
GND: C1.2 C2.1 C3.1 C4.2 C5.1 C6.1 C7.1 C8.1 C9.1 C10.1 C11.2 C12.2 C13.1 C14.2 C15.2 C16.2 C17.1 C18.2 C19.2 C20.1 C21.1 C22.1 C23.2 C24.2 C25.1 C26.2 C27.1 C28.1 C29.2 C30.2 C31.1 C32.1 C33.2 C34.2 C35.1 C36.2 C37.2 C38.2 C39.2 C40.2 C41.2 C43.1 C44.1 C45.2 C46.1 C48.1 C49.2 C50.1 C51.1 C52.2 C53.2 C54.2 CARD1.6(VSS) CARD1.10(GND) CARD1.11(GND) CARD1.12(GND) CARD1.13(GND) J1.1 J2.3 J3.1 J4.2 P2.1 P3.1 P8.1 P9.1 Q1.2(E) Q2.3(S) Q3.3(S) Q4.2(E) Q7.3(S) Q8.2(E) R2.1 R10.1 R17.1 R18.1 R19.1 R20.1 R21.1 R22.1 R24.2 R25.1 R31.1 R32.1 R33.2 R36.1 R37.1 R46.1 R47.2 R48.1 R50.1 R51.1 R52.2 R54.1 R55.1 R56.2 R59.1 R60.1 R61.1 U1.12(VSSA/VREF-) U1.18(VSS) U1.31(VSS) U1.47(VSS) U1.63(VSS) U2.1(CLKIN) U2.9(AD0) U2.11(FSYNC) U2.18(GND) U2.25(GND) U3.2(E1) U3.3(E2) U3.4(VSS) U4.4(V-) U4.5(REF) U5.4(V-) U5.5(REF) U6.4(V-) U6.5(REF) U7.4(V-) U7.5(REF) U8.4(V-) U8.5(REF) U9.3(GND) U10.3(GND) U11.1(ADJ) U12.1(ADJ(GND)) U13.4(AGND) U13.5(PGND) U14.4(AGND) U14.5(PGND) U16.4(GND) U17.4(GND) USB1.5(GND) X1.2(GND) X1.4(GND)
VDDA: C13.2 C14.1 L1.1 U1.13(VDDA/VREF+)
BOOT0: R1.1 U1.60(BOOT0)
BOOT1: R2.2 U1.28(PB2)
ComEV1: R39.2 U1.62(PB9)
ComEV2: R43.2 U1.61(PB8)
ComP: R45.2 U1.50(PA15)
COMP: C42.2 U13.2(COMP)
COMP_12V: C47.2 U14.2(COMP)
DR: Q5.4(G) U13.6(DR)
DR_12V: Q6.4(G) U14.6(DR)
DRAIN: D4.2(A) L2.2 Q5.5(D) Q5.6(D) Q5.7(D) Q5.8(D)
DRAIN_12V: D5.2(A) L3.2 Q6.5(D) Q6.6(D) Q6.7(D) Q6.8(D)
FA: R50.2 U13.7(FA/SYNS/SD)
FA_12V: R55.2 U14.7(FA/SYNS/SD)
G1: R41.1 U9.7(OUTA#)
G2: R40.1 U9.5(OUTB#)
G3: R58.1 U10.7(OUTA#)
HSE_IN: C9.2 U1.5(PH0-OSC_IN) X1.1
HSE_OUT: C10.2 U1.6(PH1-OSC_OUT) X1.3
IMU_INT: U2.12(INT)
IN0: R11.2 U1.14(PA0)
IN1: R12.2 U1.15(PA1)
IN2: R13.2 U1.16(PA2)
IN3: R14.2 U1.17(PA3)
IN4: C23.1 R27.2 U1.20(PA4)
IN5: C24.1 R26.2 U1.21(PA5)
IN6: C29.1 R34.2 U1.22(PA6)
IN7: C30.1 R35.2 U1.23(PA7)
IN8: C26.1 R29.2 U1.26(PB0)
IN9: U1.27(PB1)
IN10: R15.2 U1.8(PC0)
IN11: R16.2 U1.9(PC1)
IN12: U1.10(PC2)
IN13: U1.11(PC3)
IN14: U1.24(PC4)
IN15: U1.25(PC5)
ISENSE: R49.1 U13.1(ISEN)
ISENSE_12V: Q6.1(S) Q6.2(S) Q6.3(S) R56.1 U14.1(ISEN)
NRST: C4.1 J4.1 U1.7(NRST)
OSC32_IN: C11.1 U1.3(PC14-OSC32_IN) X2.1(OSC1)
OSC32_OUT: C12.1 U1.4(PC15-OSC32_OUT) X2.2(OSC2)
PB6_SCL: R8.1 U1.58(PB6) U2.23(SCL) U3.6(SCL)
PB7_SDA: R9.1 U1.59(PB7) U2.24(SDA) U3.5(SDA)
PWR_LED_K: LED1.1(K) R46.2
SWCLK: J1.3 U1.49(PA14)
SWDIO: J1.2 U1.46(PA13)
SWO: J1.4 U1.55(PB3)
USB_D+: U1.45(PA12) USB1.3(D+)
USB_D-: U1.44(PA11) USB1.2(D-)
uSD_CLK: CARD1.5(CLK) U1.53(PC12)
uSD_CMD: CARD1.3(CMD) R5.1 U1.54(PD2)
uSD_DAT0: CARD1.7(DAT0) R6.1 U1.39(PC8)
uSD_DAT1: CARD1.8(DAT1) R7.1 U1.40(PC9)
uSD_DAT2: CARD1.1(DAT2) R3.1 U1.42(PA9)
uSD_DAT3: CARD1.2(CD/DAT3) R4.1 U1.52(PC11)
uSD_DET: CARD1.9(CARD_DET) R10.2 U1.38(PC7)
V_PWR: C43.2 C44.2 C48.2 C50.2 L2.1 L3.1 P9.2 U13.8(VIN) U14.8(VIN)
V_SIGN: C38.1 P8.2 U12.3(VIN)
VR: U16.3(IN1+) U17.3(IN1+) U18.5(IN2+)
WC: U1.33(PB12) U3.7(WC#)
Net-(C6-2): C6.2 C7.2 U1.30(VCAP_1)
Net-(C16-1): C16.1 U2.20(CPOUT)
Net-(C18-1): C18.1 U2.10(REGOUT)
Net-(C35-2): C35.2 D3.1(C) P7.2 R44.1
Net-(C42-1): C42.1 R47.1
Net-(C46-2): C46.2 R48.2 R62.1 U13.3(FB)
Net-(C47-1): C47.1 R52.1
Net-(C51-2): C51.2 R53.2 R54.2 U14.3(FB)
Net-(C54-1): C54.1 Q5.1(S) Q5.2(S) Q5.3(S) R49.2 R51.2
Net-(D1-2): D1.2(A) P5.1 Q2.2(D)
Net-(D2-2): D2.2(A) P6.1 Q3.2(D)
Net-(D3-2): D3.2(A) P7.1 Q7.2(D)
Net-(J2-2): J2.2 U1.1(VBAT)
Net-(J3-2): J3.2 R1.2
Net-(J5-1): J5.1 R11.1 R17.2
Net-(J6-1): J6.1 R12.1 R18.2
Net-(J7-1): J7.1 R13.1 R19.2
Net-(J8-1): J8.1 R14.1 R20.2
Net-(J9-1): J9.1 R15.1 R21.2
Net-(J10-1): J10.1 R16.1 R22.2
Net-(J11-1): J11.1 R25.2 U16.2(IN1-)
Net-(J11-2): J11.2 U5.2(VIN-)
Net-(J11-3): J11.3 U5.3(VIN+)
Net-(J11-4): J11.4 U16.1(OUT1)
Net-(P1-1): P1.1 U4.3(VIN+) U18.7(OU2)
Net-(P1-2): P1.2 R24.1 U4.2(VIN-) U18.6(IN2-)
Net-(P2-2): P2.2 R32.2 U6.3(VIN+)
Net-(P2-3): P2.3 R31.2 U6.2(VIN-)
Net-(P3-2): P3.2 R37.2 U8.3(VIN+)
Net-(P3-3): P3.3 R36.2 U8.2(VIN-)
Net-(P4-1): P4.1 U7.3(VIN+) U17.1(OUT1)
Net-(P4-2): P4.2 R33.1 U7.2(VIN-) U17.2(IN1-)
Net-(Q1-1): Q1.1(B) R39.1
Net-(Q1-3): Q1.3(C) R38.1 U9.2(INA)
Net-(Q2-1): Q2.1(G) R40.2 R61.2
Net-(Q3-1): Q3.1(G) R41.2 R60.2
Net-(Q4-1): Q4.1(B) R43.1
Net-(Q4-3): Q4.3(C) R42.1 U9.4(INB)
Net-(Q7-1): Q7.1(G) R58.2 R59.2
Net-(Q8-1): Q8.1(B) R45.1
Net-(Q8-3): Q8.3(C) R57.1 U10.2(INA)
Net-(R23-1): R23.1 U5.8(RG)
Net-(R23-2): R23.2 U5.1(RG)
Net-(R26-1): R26.1 U4.6(VO)
Net-(R27-1): R27.1 U5.6(VO)
Net-(R28-1): R28.1 U6.8(RG)
Net-(R28-2): R28.2 U6.1(RG)
Net-(R29-1): R29.1 U6.6(VO)
Net-(R30-1): R30.1 U8.8(RG)
Net-(R30-2): R30.2 U8.1(RG)
Net-(R34-1): R34.1 U7.6(VO)
Net-(R35-1): R35.1 U8.6(VO)

Not connected (* = marked no-connect by the designer): R28 3*; R30 3*; R53 3*; U1 2(PC13-TAMPER-RTC) 29(PB10) 34(PB13) 35(PB14) 36(PB15) 37(PC6) 41(PA8) 43(PA10) 51(PC10) 56(PB4) 57(PB5); U2 2(NC)* 3(NC)* 4(NC)* 5(NC)* 6(AUX_DA)* 7(AUX_CL)* 14(NC)* 15(NC)* 16(NC)* 17(NC)* 19(RESV)* 21(RESV)* 22(RESV)*; U3 1(DU)*; U4 1(RG)* 8(RG)*; U7 1(RG)* 8(RG)*; U9 1(NC)* 8(NC)*; U10 1(NC)* 4(INB)* 5(OUTB#)* 8(NC)*; USB1 4(ID)* 6* 7* 8* 9*

## Notes on the sheets
sheet 1
- In order to attach an external battery
  if necessary
- BOOT0=LOW-> run state
- ST-Link programmer
- BOOT0=HIGH->
- program mode with USB
- Reset
- Internal Pull-Up resistor
- USB micro
- Microcontroller
- Oscillator
- Note: Ceramic cap
- RTC Oscillator
- I2C Interface
- ADC power supply filter
- microSD interface
sheet 2
- EEPROM
- IMU 6050 (se utilizzato)
sheet 3
- PT5402_1
- PT5402_2
- PT5402_3
- PT5402_4
- PT5423_1
- PT5423_2
- Sensori di pressione
- TM4411
- NB-PTCO_176_2
- Cond. sensore di temperatura TM4411
- Cond. NB-PTCO_176
- Sensore di spinta
- Return path
  for current
- Cella di carico
- Circuito da usare solo per i test,
   costruito su breadboard
- NB-PTCO_176_1
- Return path
  for current
- Circuito da usare solo per i test,
   costruito su breadboard
- Cond. NB-PTCO_176
- INA122: Gain=5+200k/RG
sheet 4
- Capacità da definire
  in fase di test
- Capacità da definire
  in fase di test
- MOSFET
  DRIVER
- Elettrovalvola1
- Elettrovalvola2
- Il Valore della capacità e resistenza
  è da definire in fase di test
- MOSFET
  DRIVER
- Accensione carica esplosiva
sheet 5
- Batteria
  7.4V
- Compensation
  network
- Controller_24V
- Battery for the
  power section
- This fix the
  SW frequency
- BOOST_24V
- Compensation
  network
- Controller_12V
- This fix the
  SW frequency
- BOOST_12V
